# EAGLE design 180V_power (EAGLE 6.4)
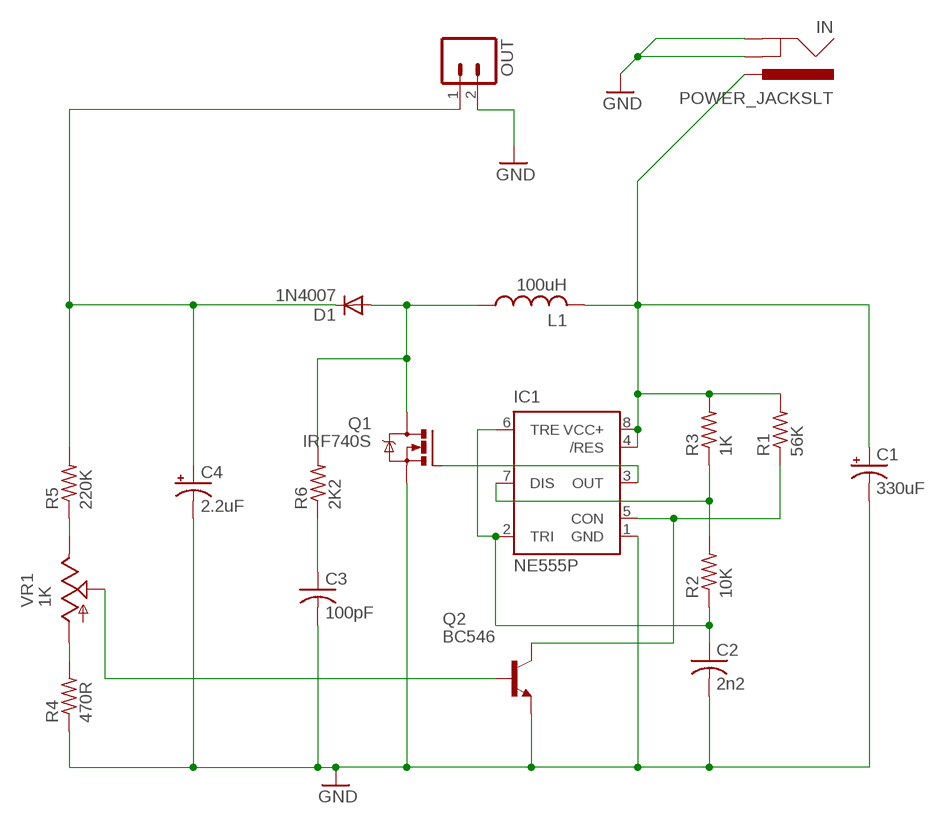
[diagram p0: schematic, sheet 1]

## Parts
C1  330uF  CAPACITOR_POLE5-10.5  [E5-10,5]
C2  2n2  CAPACITORC1206K  [C1206K]
C3  100pF  CAPACITORC1206K  [C1206K]
C4  2.2uF  CAPACITOR_POLE3.5-8  [E3,5-8]
D1  1N4007  DIODESMA  [SMA-DIODE]
IC1  NE555P  [DIL08]
IN  POWER_JACKSLT  [POWER_JACK_SLOT]
L1  100uH  INDUCTORTFI0307  [TFI0307]
OUT  M023.5MM  [SCREWTERMINAL-3.5MM-2]
Q1  IRF740S  [TO263]
Q2  BC546  BC546A  [TO92-EBC]
R1  56K  RESISTORR1206  [R1206]
R2  10K  RESISTORR1206  [R1206]
R3  1K  RESISTORR1206  [R1206]
R4  470R  RESISTOR0207/10  [0207/10]
R5  220K  RESISTOR0207/10  [0207/10]
R6  2K2  RESISTORR1206  [R1206]
VR1  1K  TRIM_POTCA6V  [CA6V]

## Nets
GND: C1.- C2.2 C3.2 C4.- IC1.1(GND) IN.GND@1(GNDBREAK) IN.GND@2(GND) OUT.2 Q1.2(S) Q2.E R4.1
N$1: IC1.3(OUT) Q1.1(G)
N$2: C3.1 R6.1
N$3: IC1.5(CON) Q2.C R1.1
N$4: IC1.7(DIS) R2.2 R3.1
N$5: C2.1 IC1.2(TRI) IC1.6(TRE) R2.1
N$6: D1.A L1.1 Q1.3(D) R6.2
N$7: C4.+ D1.C OUT.1 R5.2
N$8: R5.1 VR1.E
N$9: R4.2 VR1.A
N$10: Q2.B VR1.S
N$26: C1.+ IC1.4(/RES) IC1.8(VCC+) IN.PWR L1.2 R1.2 R3.2

## Library data of the parts
C1 C4 = iStivi - RCLD:CAPACITOR_POL: POLARIZED CAPACITOR, American symbol
C2 C3 = iStivi - RCLD:CAPACITOR: CAPACITOR, American symbol
D1 = iStivi - RCLD:DIODE: Diode These are standard reverse protection diodes and small signal diodes.
IC1 = iStivi - ICs:NE555: Timer General purpose bipolar Timer; MF: Arrow Electronics; MPN: NE555N; OC_FARNELL: 1467742; OC_NEWARK: 89K1486
IN = iStivi - Header-Connector:POWER_JACK: Power Jack This is the standard 5.5mm barrel jack for power. The PTH is the most common, proven, reliable, footprint. The Slot footprint only works if the mill layer is transmitted to the PCB fab house so be warned. Spark Fun Electronics SKU : PRT-00119 SMT: CONN-08106 Mating wall wart : TOL-00298 (and others)
L1 = iStivi - RCLD:INDUCTOR: INDUCTOR
OUT = iStivi - Header-Connector:M02: Header 2 Standard 2-pin 0.1" header. Use with straight break away headers (SKU : PRT-00116), right angle break away headers (PRT-00553), swiss pins (PRT-00743), machine pins (PRT-00117), and female headers (PRT-00115). Molex polarized connector foot print use with SKU : PRT-08233 with associated crimp pins and housings.
Q1 = iStivi - Transistor-FET:IRF740: N-CHANNEL MOS FET 400V MOSFET
Q2 = iStivi - Transistor-FET-reg:BC546*: NPN Transistor
R1-R6 = iStivi - RCLD:RESISTOR: RESISTOR
VR1 = iStivi - RCLD:TRIM_POT: POTENTIOMETER

## Board
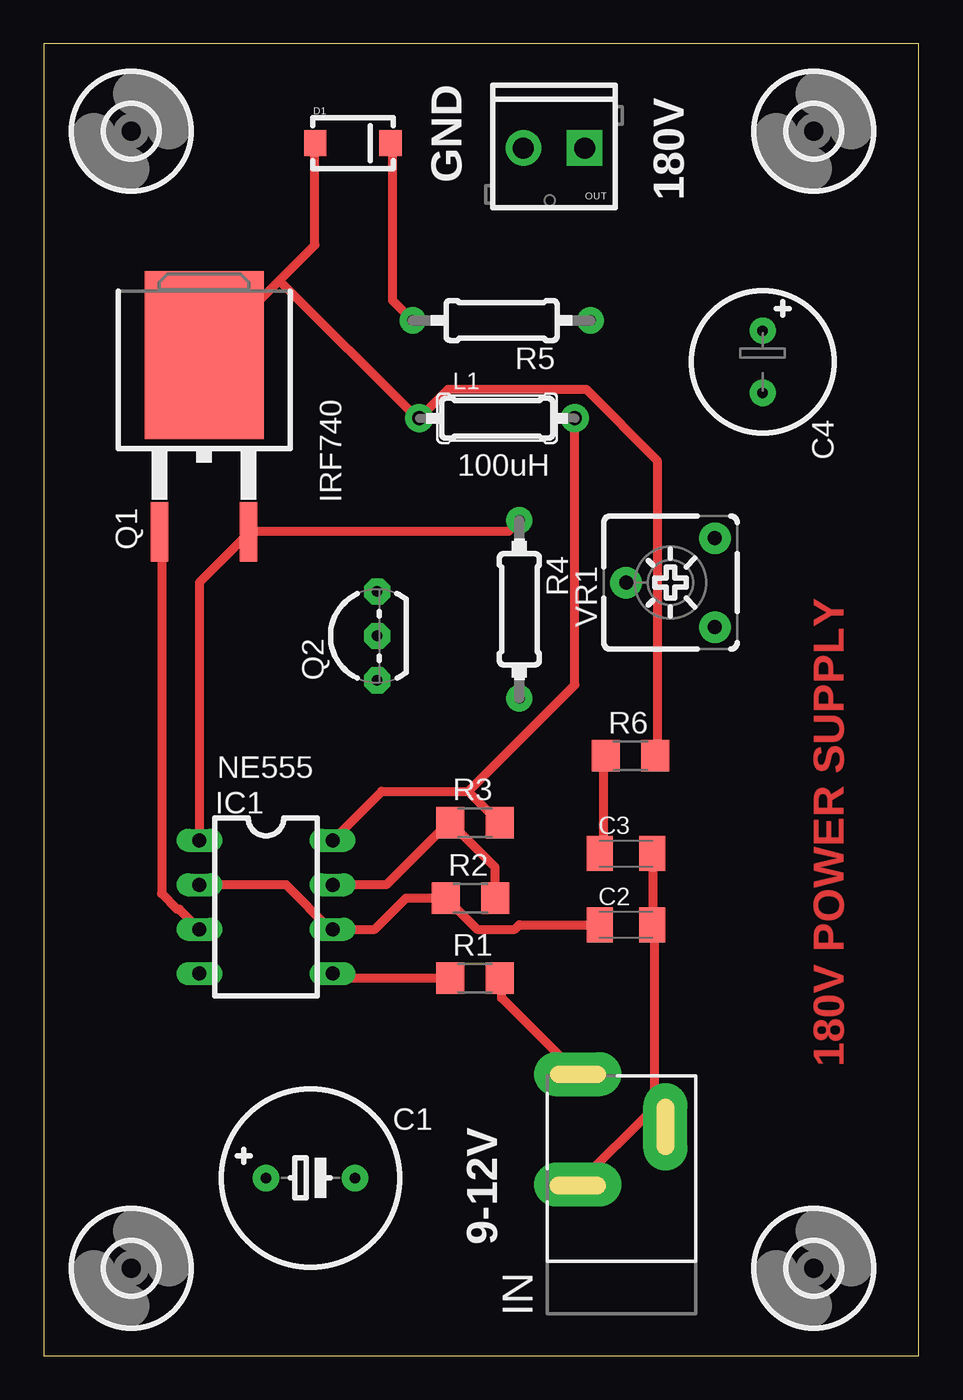
[diagram p1: board, top side]
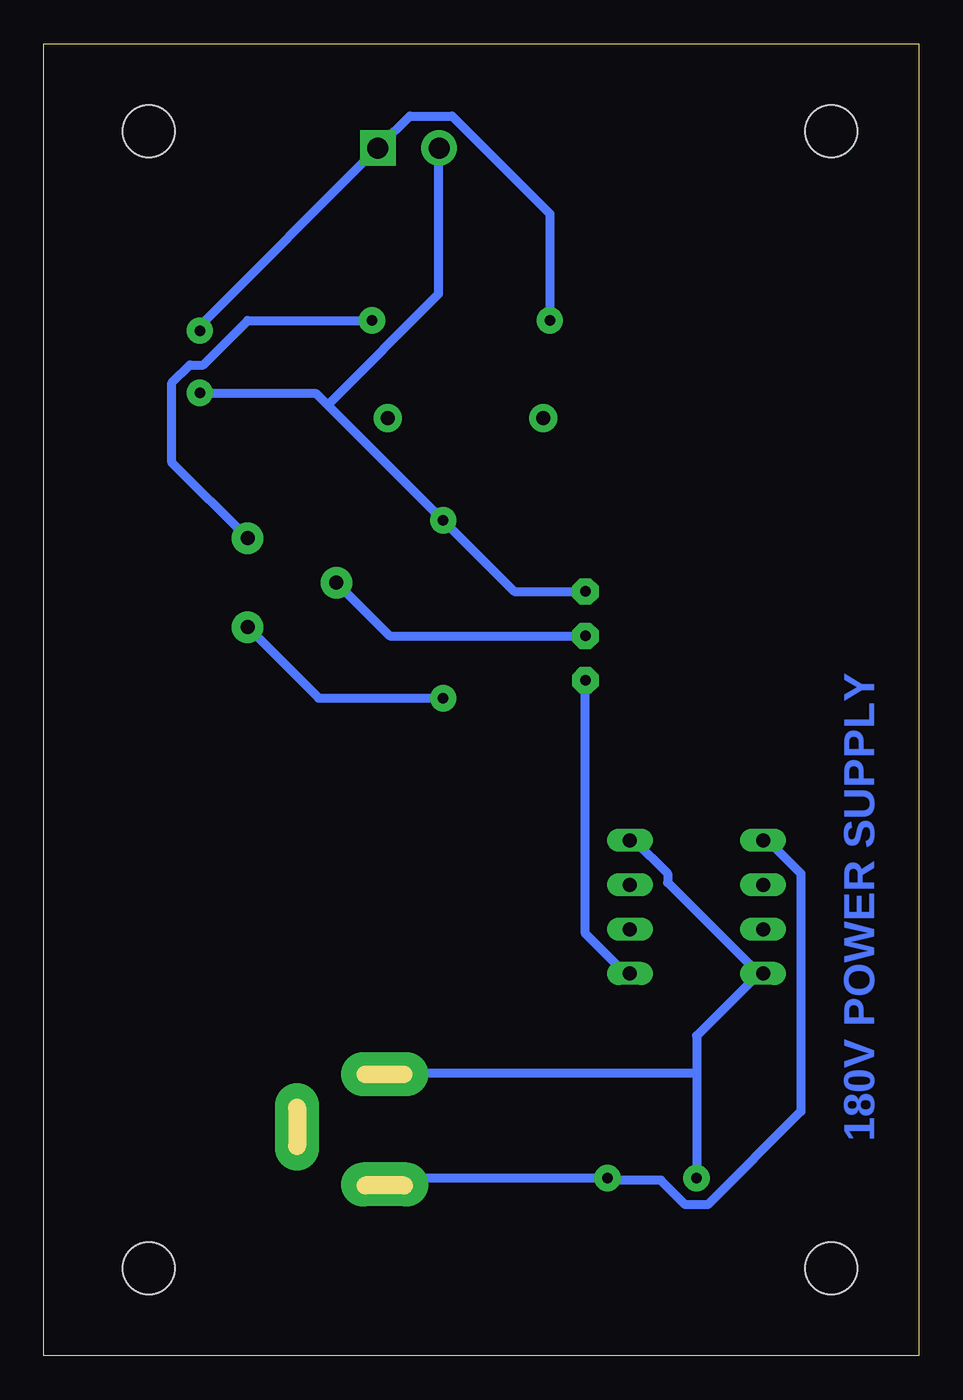
[diagram p2: board, bottom side, seen from below]

Size 50 x 75 mm. Coordinates in mm from the lower left corner, seen from the top.
Outline: 0,0 50,0 50,75 0,75 0,0
Copper layers (1*16): Top 0.035mm / dielectric 1.5mm / Bottom 0.035mm
Design rules "iStivi-0.8mm via-20mil-track": minimum track width 20mil, minimum drill 0.8mm, track to track 20mil, track to pad 20mil, pad to pad 10mil, via to via 20mil, smd to smd 10mil, copper to edge 40mil, drill to drill 8mil, minimum pad ring 10mil, minimum via ring 16mil, stop-mask expansion 0mil, vias tented up to drill 0mil, thermal gap 12mil
tRestrict: area 32.3,42.4 to 33.9,45.5; area 36.9,46 to 40,47.5; area 36.9,41.1 to 40,42.7; area 11.2,8.9 to 14.2,11.4; area 16.5,8.6 to 19.3,11.4; area 26.3,68 to 28.6,70.3; area 29.9,68 to 32.2,70.3; area 40.1,57.7 to 42.2,59.4; area 40.1,54.1 to 42.2,55.9; area 17.5,37.6 to 20.6,44.7

### Footprints (pad centres in the part's own frame; a part is rotated, then mirrored left to right if it is on the bottom)
E5-10,5 = drill 0.6 pad 1.5: + -2.54,0; - 2.54,0
C1206K = smd 1.5 x 2: 1 -1.5,0; 2 1.5,0
E3,5-8 = drill 0.6 pad 1.5: + -1.778,0; - 1.778,0
SMA-DIODE = smd 1.27 x 1.47: A -2.15,0; C 2.15,0
DIL08 = drill 0.8 long: 1 -3.81,-3.81; 2 -1.27,-3.81; 3 1.27,-3.81; 4 3.81,-3.81; 5 3.81,3.81; 6 1.27,3.81; 7 -1.27,3.81; 8 -3.81,3.81
POWER_JACK_SLOT = drill 0.8 pad 2.5 long: GND@1 2.58,7.5; GND@2 7.58,10.8; PWR 2.58,13.8
TFI0307 = drill 0.8 pad 1.6: 1 -4.445,0; 2 4.445,0
SCREWTERMINAL-3.5MM-2 = drill 1.2 pad 2.032 square: 1 0,0 | drill 1.2 pad 2.032: 2 3.5,0
TO263 = smd 1 x 3.4: 1 -2.54,-6.6; 2 2.54,-6.6 | smd 6.8 x 9.6: 3 0,3.5
TO92-EBC = drill 0.6 pad 1.5 octagon: B 0,-1.27; C -2.54,-1.27; E 2.54,-1.27
R1206 = smd 1.6 x 1.803: 1 -1.422,0; 2 1.422,0
0207/10 = drill 0.6 pad 1.5: 1 -5.08,0; 2 5.08,0
3,0 = hole 3: 0,0
CA6V = drill 0.8 pad 1.8: A -2.54,-2.54; E 2.54,-2.54; S 0,2.54

### Placement (x,y rotation side)
C1  15.24,10.16 0 top
C2  33.27,24.64 0 top
C3  33.27,28.7 0 top
C4  41.08,56.82 270 top
D1  17.67,69.31 0 top
IC1  12.7,25.65 270 top
IN  27.94,2.29 0 top
L1  25.91,53.59 0 top
OUT  30.91,69.04 180 top
Q1  9.16,53.69 0 top
Q2  17.78,41.15 90 top
R1  24.64,21.59 0 top
R2  24.38,26.16 0 top
R3  24.64,30.48 0 top
R4  27.18,42.67 270 top
R5  26.16,59.18 180 top
R6  33.53,34.29 0 top
U$1  [3,0]  5,5 0 top
U$2  [3,0]  44,5 0 top
U$3  [3,0]  44,70 0 top
U$4  [3,0]  5,70 0 top
VR1  35.81,44.2 90 top

### Tracks (layer width: path | path; a pad name or v marks a point on that pad's centre or on a via)
GND
  Top 0.508: C3.2 34.8,28.7 34.8,24.64 C2.2 34.92,24.51 34.92,13.72 35.43,13.21 IN.GND@2 34.8,14.1 30.61,9.91 IN.GND@1 | IC1.1 8.89,44.2 11.68,46.99 Q1.2 11.94,47.12 26.54,47.12 R4.1
  Bottom 0.508: IN.GND@1 30.48,9.91 30.23,10.16 C1.- 17.65,10.03 14.73,10.03 13.34,8.64 12.06,8.64 6.73,13.97 6.73,27.56 8.64,29.46 IC1.1 | Q2.E 23.11,43.69 R4.1 33.78,54.36 | 33.78,54.36 34.42,54.99 41.02,54.99 C4.- | 33.78,54.36 27.43,60.71 27.43,68.96 OUT.2
N$1
  Top 0.508: IC1.3 7.75,25.53 7.62,25.53 6.73,26.42 6.73,46.99 Q1.1
N$2
  Top 0.508: R6.1 32,34.29 32,28.83 31.88,28.7 C3.1
N$3
  Top 0.508: R1.1 16.76,21.59 IC1.5
  Bottom 0.508: Q2.C 19.05,24.13 16.76,21.84 IC1.5
N$4
  Top 0.508: R2.2 25.78,26.16 25.78,27.94 23.24,30.48 R3.1 22.99,30.35 19.56,26.92 IC1.7
N$5
  Top 0.508: C2.1 27.18,24.64 26.92,24.38 24.77,24.38 23.11,26.04 R2.1 20.7,26.16 18.92,24.38 IC1.6 16.38,24.38 13.84,26.92 IC1.2
N$6
  Top 0.508: 13.46,61.47 9.27,57.28 Q1.3 | 13.46,61.47 15.49,63.5 15.49,69.22 D1.A | R6.2 35.05,34.29 35.05,51.18 30.99,55.24 23.11,55.24 L1.1 21.34,53.59 13.46,61.47
N$7
  Top 0.508: R5.2 19.94,60.33 19.94,69.22 D1.C
  Bottom 0.508: C4.+ 41.02,58.67 41.02,58.93 30.99,68.96 OUT.1 30.73,69.22 29.08,70.87 26.67,70.87 21.08,65.28 R5.2
N$8
  Bottom 0.508: R5.1 38.35,59.18 40.89,56.64 41.66,56.64 42.67,55.63 42.67,51.05 VR1.E
N$9
  Bottom 0.508: R4.2 34.29,37.59 VR1.A
N$10
  Bottom 0.508: Q2.B 30.23,41.15 VR1.S
N$26
  Top 0.508: R1.2 26.16,21.59 26.16,20.45 30.48,16.13 IN.PWR | 24.26,32.26 26.04,30.48 R3.2 | 24.26,32.26 19.3,32.26 IC1.8 | L1.2 30.35,38.35 24.26,32.26
  Bottom 0.508: IC1.8 16.26,29.46 14.35,27.56 14.35,27.05 9.14,21.84 IC1.4 9.27,21.72 12.7,18.29 12.7,16.13 | 12.7,16.13 C1.+ | 12.7,16.13 30.48,16.13 IN.PWR

### Text on the board
Top: 180V POWER SUPPLY
Bottom: 180V POWER SUPPLY
_tplace: GND | 180V | 100uH | IRF740 | NE555 | 9-12V